# EAGLE design term_clock (EAGLE 9.2.2)
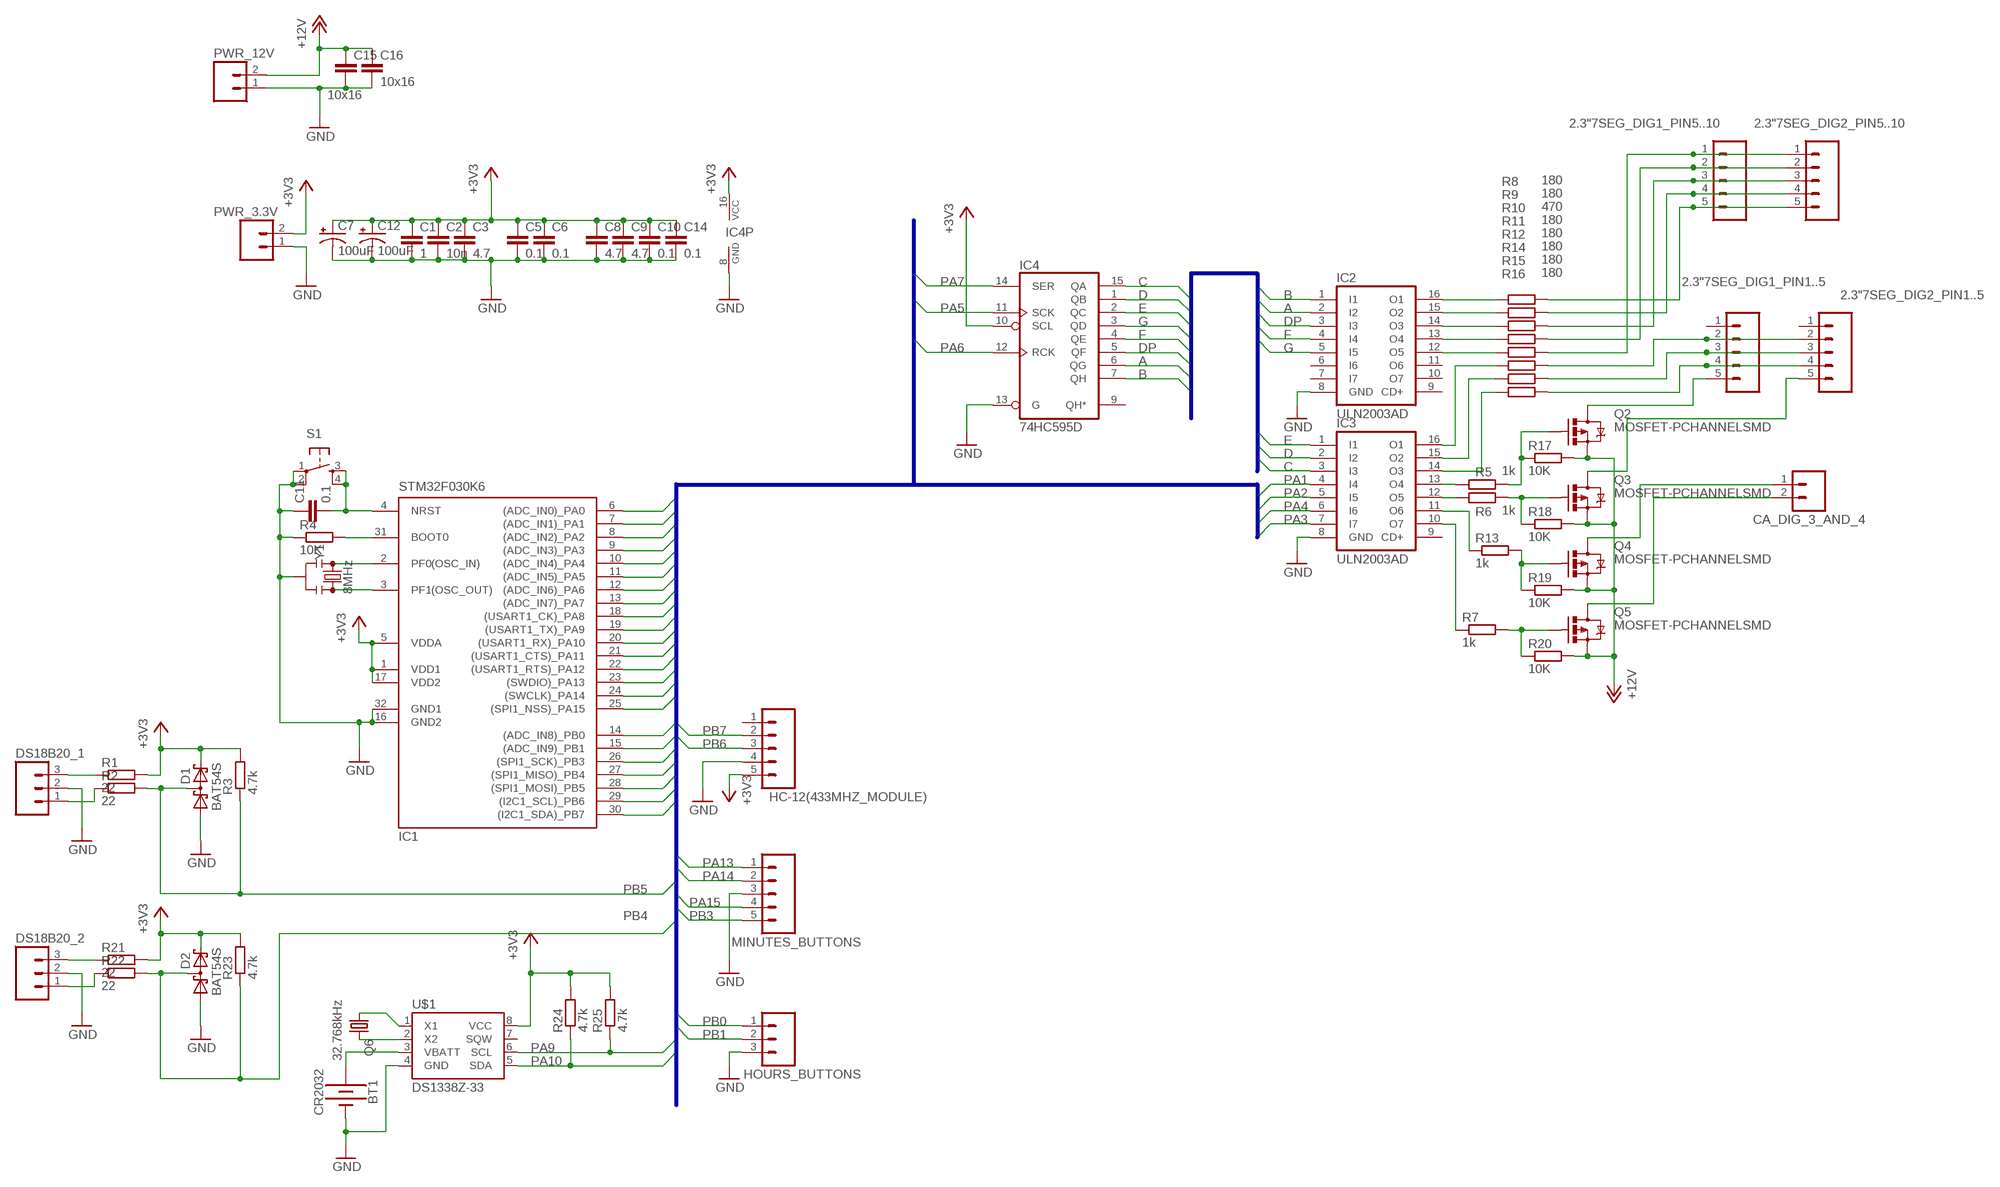
[diagram p0: schematic, sheet 1]

## Parts
2.3"7SEG_DIG1_PIN1..5  M05  [05P]
2.3"7SEG_DIG1_PIN5..10  M05  [05P]
2.3"7SEG_DIG2_PIN1..5  M05  [05P]
2.3"7SEG_DIG2_PIN5..10  M05  [05P]
BT1  CR2032  BATTERY-20MM_PTH  [BATTCOM_20MM_PTH]
C1  1  C-EUC0805  [C0805]
C2  10n  C-EUC0805  [C0805]
C3  4.7  C-EUC0805  [C0805]
C5  0.1  C-EUC0805  [C0805]
C6  0.1  C-EUC0805  [C0805]
C7  100uF  100UF-POLAR-EIA7343-16V-10%(TANT)  [EIA7343]
C8  4.7  C-EUC0805  [C0805]
C9  4.7  C-EUC0805  [C0805]
C10  0.1  C-EUC0805  [C0805]
C11  0.1  C-EUC0805  [C0805]
C12  100uF  100UF-POLAR-EIA7343-16V-10%(TANT)  [EIA7343]
C14  0.1  C-EUC0805  [C0805]
C15  10x16  C-EUC1206  [C1206]
C16  10x16  C-EUC1206  [C1206]
CA_DIG_3_AND_4  M02  [02P]
D1  BAT54S  [SOT23]
D2  BAT54S  [SOT23]
DS18B20_1  M03  [03P]
DS18B20_2  M03  [03P]
HC-12(433MHZ_MODULE)  M05  [05P]
HOURS_BUTTONS  M03  [03P]
IC1  STM32F030K6  [TQFP32-08]
IC2  ULN2003AD  [SO16]
IC3  ULN2003AD  [SO16]
IC4  74HC595D  [SO16]
MINUTES_BUTTONS  M05  [05P]
PWR_3.3V  M02  [02P]
PWR_12V  M02  [02P]
Q2  MOSFET-PCHANNELSMD  [SOT23-3]
Q3  MOSFET-PCHANNELSMD  [SOT23-3]
Q4  MOSFET-PCHANNELSMD  [SOT23-3]
Q5  MOSFET-PCHANNELSMD  [SOT23-3]
Q6  32.768kHz  CRYSTALTC38H  [TC38H]
R1  22  R-EU_R0805  [R0805]
R2  22  R-EU_R0805  [R0805]
R3  4.7k  R-EU_R0805  [R0805]
R4  10K  R-EU_R0805  [R0805]
R5  1k  R-EU_R0603  [R0603]
R6  1k  R-EU_R0603  [R0603]
R7  1k  R-EU_R0603  [R0603]
R8  180  R-EU_R1206  [R1206]
R9  180  R-EU_R1206  [R1206]
R10  470  R-EU_R1206  [R1206]
R11  180  R-EU_R1206  [R1206]
R12  180  R-EU_R1206  [R1206]
R13  1k  R-EU_R0603  [R0603]
R14  180  R-EU_R1206  [R1206]
R15  180  R-EU_R1206  [R1206]
R16  180  R-EU_R1206  [R1206]
R17  10K  R-EU_R0603  [R0603]
R18  10K  R-EU_R0603  [R0603]
R19  10K  R-EU_R0603  [R0603]
R20  10K  R-EU_R0603  [R0603]
R21  22  R-EU_R0805  [R0805]
R22  22  R-EU_R0805  [R0805]
R23  4.7k  R-EU_R0805  [R0805]
R24  4.7k  R-EU_R0805  [R0805]
R25  4.7k  R-EU_R0805  [R0805]
S1  TAC_SWITCHSMD  [TACTILE_SWITCH_SMD]
U$1  DS1338Z-33  DS1307SO8  [SO08]
Y1  8MHz  RESONATOR-8MHZSMD_3.2X1.3  [RESONATOR-SMD-3.2X1.3]

## Nets
+3V3: C1.1 C2.1 C3.1 C5.1 C6.1 C7.A(+) C8.1 C9.1 C10.1 C12.A(+) C14.1 D1.2(C2) D2.2(C2) HC-12(433MHZ_MODULE).5 IC1.1(VDD1) IC1.5(VDDA) IC1.17(VDD2) IC4.10(SCL) IC4.16(VCC) PWR_3.3V.2 R1.2 R3.2 R21.2 R23.2 R24.2 R25.2 U$1.8(VCC)
+12V: C15.1 C16.1 PWR_12V.2 Q2.2(S) Q3.2(S) Q4.2(S) Q5.2(S) R17.2 R18.2 R19.2 R20.2
A: IC2.2(I2) IC4.6(QG)
B: IC2.1(I1) IC4.7(QH)
C: IC3.3(I3) IC4.15(QA)
D: IC3.2(I2) IC4.1(QB)
DP: IC2.3(I3) IC4.5(QF)
E: IC3.1(I1) IC4.2(QC)
F: IC2.4(I4) IC4.4(QE)
G: IC2.5(I5) IC4.3(QD)
GND: BT1.2(-) C1.2 C2.2 C3.2 C5.2 C6.2 C7.C(-) C8.2 C9.2 C10.2 C11.1 C12.C(-) C14.2 C15.2 C16.2 D1.1(A1) D2.1(A1) DS18B20_1.2 DS18B20_2.2 HC-12(433MHZ_MODULE).4 HOURS_BUTTONS.3 IC1.16(GND2) IC1.32(GND1) IC2.8(GND) IC3.8(GND) IC4.8(GND) IC4.13(G) MINUTES_BUTTONS.3 PWR_3.3V.1 PWR_12V.1 R4.1 S1.1 S1.2 U$1.4(GND) Y1.2
N$2: DS18B20_1.3 R1.1
N$3: IC1.2(PF0(OSC_IN)) Y1.1
N$4: IC1.3(PF1(OSC_OUT)) Y1.3
N$5: DS18B20_1.1 R2.1
N$6: DS18B20_2.3 R21.1
N$7: IC1.31(BOOT0) R4.2
N$8: DS18B20_2.1 R22.1
N$10: Q6.2 U$1.2(X2)
N$11: Q6.1 U$1.1(X1)
N$13: BT1.1(+) U$1.3(VBATT)
N$20: C11.2 IC1.4(NRST) S1.3 S1.4
N$81: IC2.16(O1) R8.1
N$82: IC2.15(O2) R9.1
N$83: IC2.14(O3) R10.1
N$84: IC2.13(O4) R11.1
N$85: IC2.12(O5) R12.1
N$86: Q3.1(G) R6.2 R18.1
N$87: Q4.1(G) R13.2 R19.1
N$88: Q5.1(G) R7.2 R20.1
N$89: 2.3"7SEG_DIG2_PIN1..5.5 Q3.3(D)
N$90: CA_DIG_3_AND_4.1 Q4.3(D)
N$91: CA_DIG_3_AND_4.2 Q5.3(D)
N$97: 2.3"7SEG_DIG1_PIN5..10.5 2.3"7SEG_DIG2_PIN5..10.5 R8.2
N$98: 2.3"7SEG_DIG1_PIN5..10.4 2.3"7SEG_DIG2_PIN5..10.4 R9.2
N$99: 2.3"7SEG_DIG1_PIN5..10.3 2.3"7SEG_DIG2_PIN5..10.3 R10.2
N$100: 2.3"7SEG_DIG1_PIN5..10.2 2.3"7SEG_DIG2_PIN5..10.2 R11.2
N$101: 2.3"7SEG_DIG1_PIN5..10.1 2.3"7SEG_DIG2_PIN5..10.1 R12.2
N$102: 2.3"7SEG_DIG1_PIN1..5.5 Q2.3(D)
N$103: 2.3"7SEG_DIG1_PIN1..5.2 2.3"7SEG_DIG2_PIN1..5.2 R14.2
N$104: 2.3"7SEG_DIG1_PIN1..5.3 2.3"7SEG_DIG2_PIN1..5.3 R15.2
N$105: 2.3"7SEG_DIG1_PIN1..5.4 2.3"7SEG_DIG2_PIN1..5.4 R16.2
N$106: IC3.10(O7) R7.1
N$107: IC3.11(O6) R13.1
N$108: IC3.12(O5) R6.1
N$109: Q2.1(G) R5.2 R17.1
N$110: IC3.13(O4) R5.1
N$118: IC3.16(O1) R14.1
N$119: IC3.15(O2) R15.1
N$120: IC3.14(O3) R16.1
PA0: IC1.6((ADC_IN0)_PA0)
PA1: IC1.7((ADC_IN1)_PA1) IC3.4(I4)
PA2: IC1.8((ADC_IN2)_PA2) IC3.5(I5)
PA3: IC1.9((ADC_IN3)_PA3) IC3.7(I7)
PA4: IC1.10((ADC_IN4)_PA4) IC3.6(I6)
PA5: IC1.11((ADC_IN5)_PA5) IC4.11(SCK)
PA6: IC1.12((ADC_IN6)_PA6) IC4.12(RCK)
PA7: IC1.13((ADC_IN7)_PA7) IC4.14(SER)
PA8: IC1.18((USART1_CK)_PA8)
PA9: IC1.19((USART1_TX)_PA9) R25.1 U$1.6(SCL)
PA10: IC1.20((USART1_RX)_PA10) R24.1 U$1.5(SDA)
PA11: IC1.21((USART1_CTS)_PA11)
PA12: IC1.22((USART1_RTS)_PA12)
PA13: IC1.23((SWDIO)_PA13) MINUTES_BUTTONS.1
PA14: IC1.24((SWCLK)_PA14) MINUTES_BUTTONS.2
PA15: IC1.25((SPI1_NSS)_PA15) MINUTES_BUTTONS.4
PB0: HOURS_BUTTONS.1 IC1.14((ADC_IN8)_PB0)
PB1: HOURS_BUTTONS.2 IC1.15((ADC_IN9)_PB1)
PB3: IC1.26((SPI1_SCK)_PB3) MINUTES_BUTTONS.5
PB4: D2.3(C1A2) IC1.27((SPI1_MISO)_PB4) R22.2 R23.1
PB5: D1.3(C1A2) IC1.28((SPI1_MOSI)_PB5) R2.2 R3.1
PB6: HC-12(433MHZ_MODULE).3 IC1.29((I2C1_SCL)_PB6)
PB7: HC-12(433MHZ_MODULE).2 IC1.30((I2C1_SDA)_PB7)
Unconnected: 2.3"7SEG_DIG1_PIN1..5.1 2.3"7SEG_DIG2_PIN1..5.1 HC-12(433MHZ_MODULE).1 IC2.6(I6) IC2.7(I7) IC2.9(CD+) IC2.10(O7) IC2.11(O6) IC3.9(CD+) IC4.9(QH*) U$1.7(SQW)

## Buses
A,B,C,D,E,F,G,DP
PA[0..15],PB[0..7]

## Library data of the parts
2.3"7SEG_DIG1_PIN1..5 2.3"7SEG_DIG1_PIN5..10 2.3"7SEG_DIG2_PIN1..5 2.3"7SEG_DIG2_PIN5..10 HC-12(433MHZ_MODULE) MINUTES_BUTTONS = con-amp-quick:M05: AMP QUICK CONNECTOR; OC_FARNELL: unknown; OC_NEWARK: unknown
BT1 = SparkFun-Batteries:BATTERY: Battery - Single Cell A variety of battery chemistries, sizes, and footprints. Device List: 20MM_PTH - Coin Cell Battery Holder - 20mm (PTH) <https://www.sparkfun.com/products/783> 6.8MM_PTH - Coin Cell Battery Holder - 6.8MM(SMD) <https://www.digikey.com/product-detail/en/seiko-instruments/MS621FE-FL11E/728-1057-ND/1889208?WT.srch=1&gclid=CNOQ5a6LzdQCFZS2wAodXCkE0g> 12MM_SMD - Coin Cell Battery Holder - 12mm (SMD) <https://www.sparkfun.com/products/10592> 12MM_PTH - Coin Cell Battery Holder - 12mm (PTH) <https://www.sparkfun.com/products/7948> 20MM_SMD - 20mm Coin Cell Battery Holder (SMD) (2 legs) Used on the Big Time Watch Kit <https://www.sparkfun.com/products/11734> 20MM_SMD_4LEGS - Coin Cell Battery Holder - 20mm (SMD) <https://www.sparkfun.com/products/11892> 20MM_SMD_4LEGS_OVERPASTE - Coin Cell Battery Holder - 20mm (SMD) <https://www.sparkfun.com/products/11892> (Over-paste on the legs) 24.5MM_PTH - Coin Cell Battery Holder - 24.5mm (PTH) <https://www.sparkfun.com/products/8863> 9V - 9V Battery Holder - PC Mount Used on the SparkFun SparkPunk Sound Kit <https://www.sparkfun.com/products/11177> and SparkFun SparkPunk Sequencer Kit <https://www.sparkfun.com/products/12707> 18650 - Battery Holder - 18650 (PTH) <https://www.sparkfun.com/products/13113> AA - Battery Holder - 1xAA (PTH) <https://www.sparkfun.com/products/7949> AAA - Battery Holder - 1xAAA (PTH) <https://www.sparkfun.com/products/12718> AA_KIT - Battery Holder - 1xAA (PTH) <https://www.sparkfun.com/products/7949> Special kit package - pads only have exposed copper on one side of the board. AAA_KIT - Battery Holder - 1xAAA (PTH) <https://www.sparkfun.com/products/12718> Special kit package - pads only have exposed copper on one side of the board.; PROD_ID: BATT-09031; SF_SKU: PRT-00783
C1-C3 C5 C6 C8-C11 C14-C16 = resistor:C-EU: CAPACITOR, European symbol; SPICEPREFIX: C
C7 C12 = SparkFun-Capacitors:100UF-POLAR: 100µF polarized capacitors A capacitor is a passive two-terminal electrical component used to store electrical energy temporarily in an electric field.; PROD_ID: CAP-08702
CA_DIG_3_AND_4 PWR_3.3V PWR_12V = con-amp-quick:M02: AMP QUICK CONNECTOR; OC_FARNELL: unknown; OC_NEWARK: unknown
D1 D2 = diode:BAT54S: Schottky Diodes Pin connection corrected 2011-05-04 Source: Fairchild .. BAT54.pdf
DS18B20_1 DS18B20_2 HOURS_BUTTONS = con-amp-quick:M03: AMP QUICK CONNECTOR; OC_FARNELL: unknown; OC_NEWARK: unknown
IC1 = my:STM32F030K6: MICROCONTROLLER 32 Kbytes FLASH, 4 kbytes SRAM, USART, SPI, 10-channel 12 bit ADC,
IC2 IC3 = uln-udn:ULN2003A: DRIVER ARRAY
IC4 = 74xx-eu:74*595: 8-bit SHIFT REGISTER, output latch
Q2-Q5 = SparkFun:MOSFET-PCHANNEL
Q6 = crystal:CRYSTAL: CRYSTAL; OC_FARNELL: unknown; OC_NEWARK: unknown
R1-R25 = resistor:R-EU_: RESISTOR, European symbol; SPICEPREFIX: R
S1 = SparkFun:TAC_SWITCH: Momentary Switch Button commonly used for reset or general input. Spark Fun Electronics SKU : COM-00097
U$1 = SparkFun:DS1307
Y1 = SparkFun-Clocks:RESONATOR-8MHZ: 8MHz Resonator Digikey Example <http://www.digikey.com/product-detail/en/murata-electronics-north-america/CSTCE10M0G55-R0/490-1196-1-ND/584633> Frequency: 8MHz Frequency Stability: ±0.2% Frequency Tolerance: ±0.5% Capacitance: 33pF SparkFun Products Arduino Pro Mini 328- 3.3V/8MHz <https://www.sparkfun.com/products/11114> SparkFun Digital Sandbox <https://www.sparkfun.com/products/12651>; PROD_ID: XTAL-08895

## Board
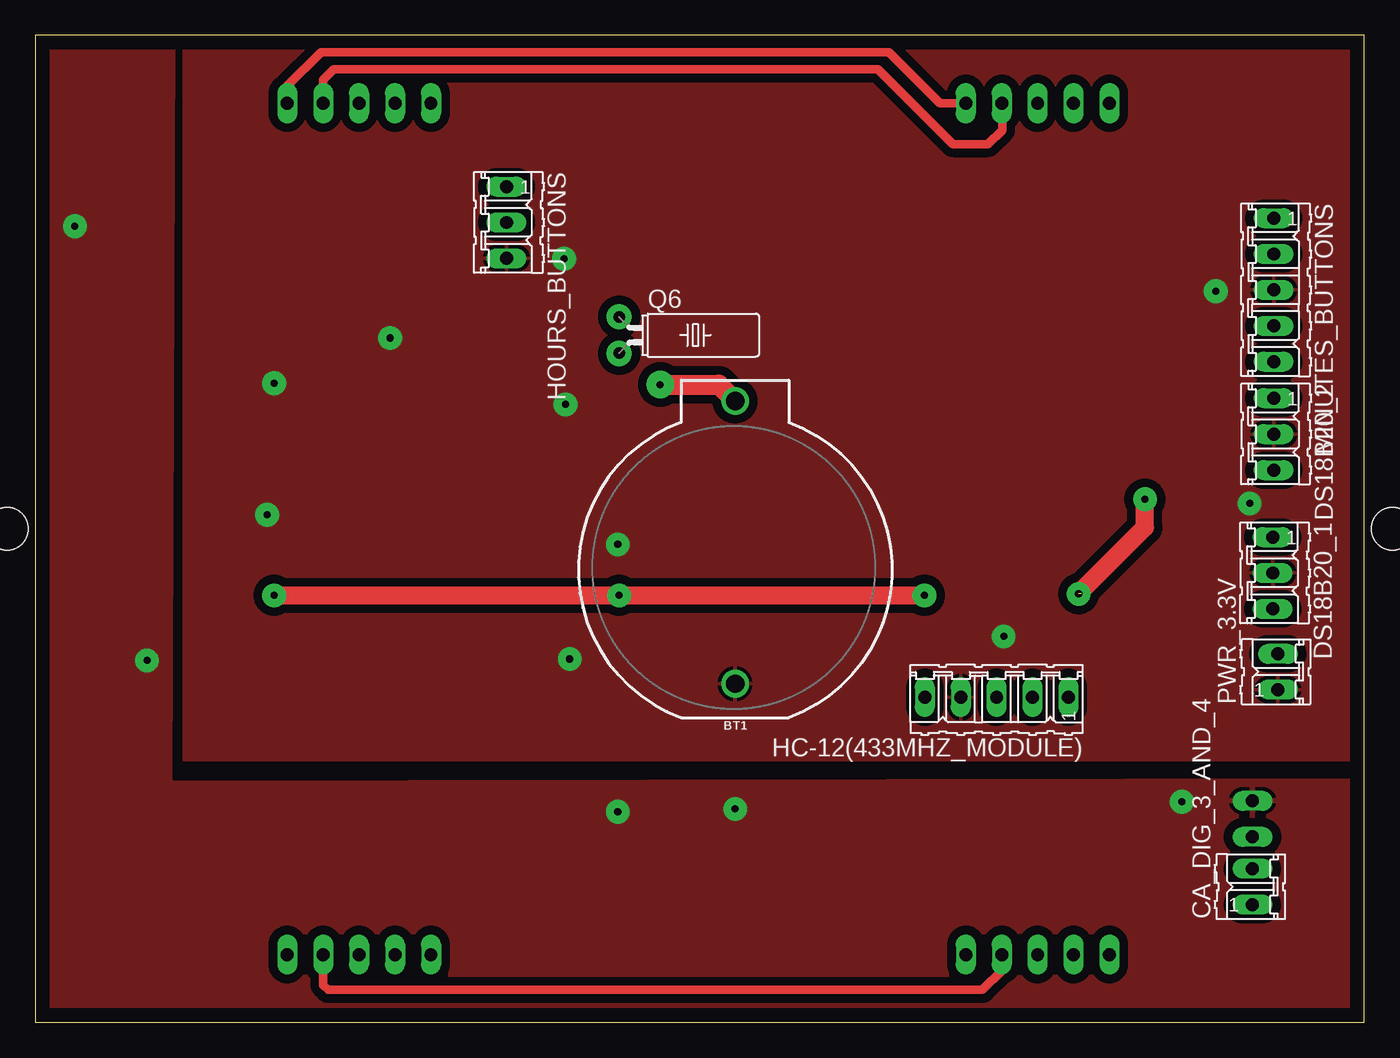
[diagram p1: board, top side]
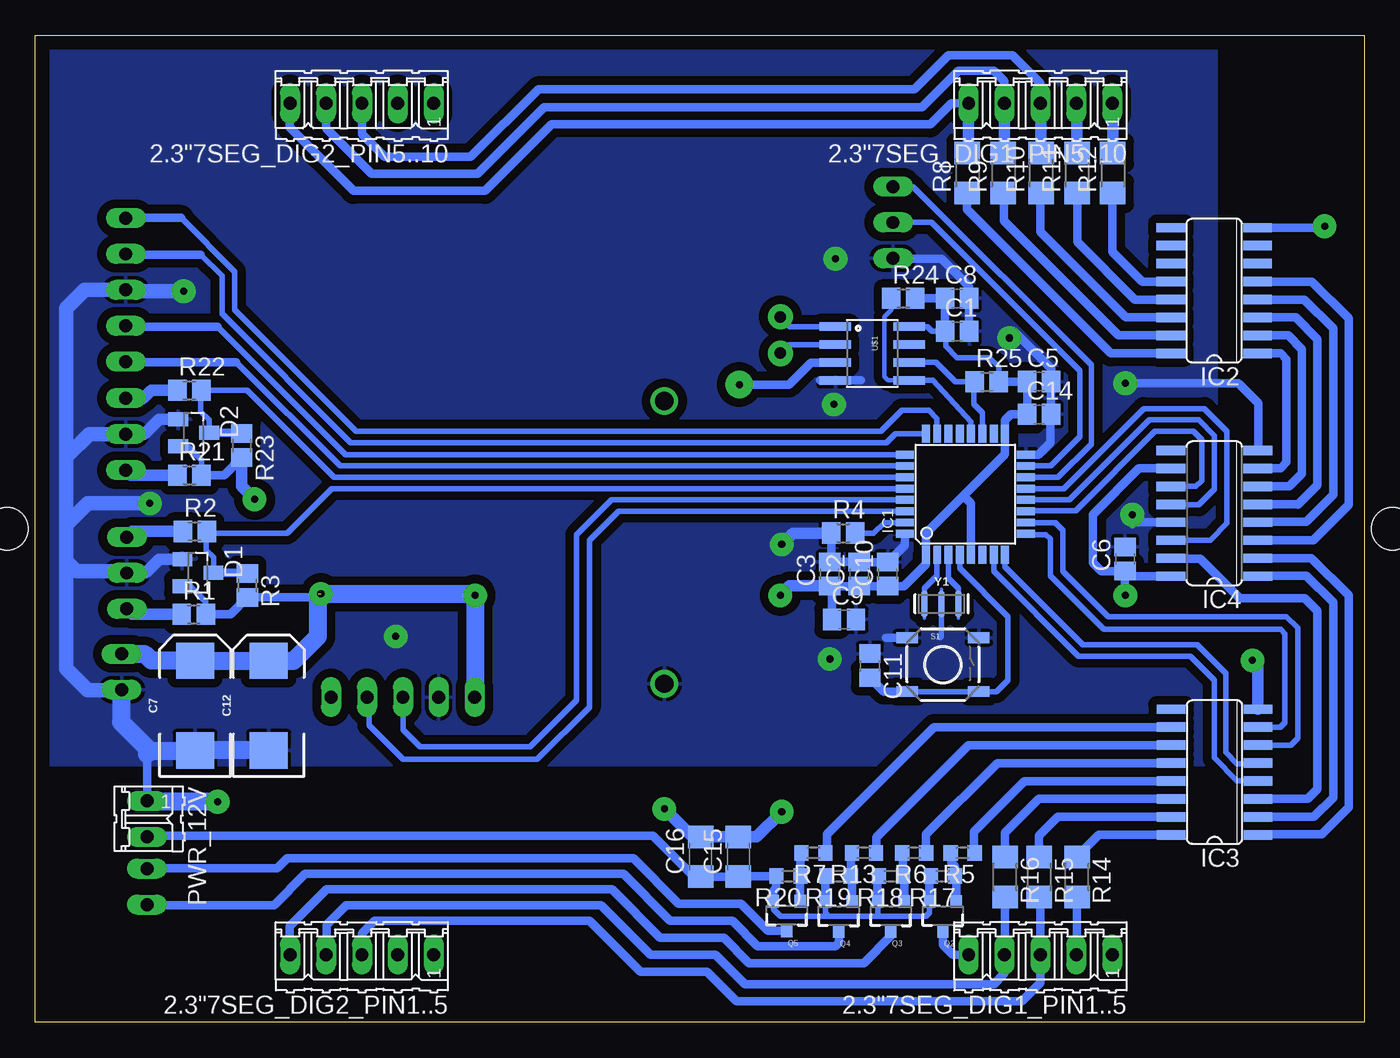
[diagram p2: board, bottom side, seen from below]

Size 94 x 69.8 mm. Coordinates in mm from the lower left corner, seen from the top.
Outline: 0,0 94,0 94,69.8 0,69.8 0,0
Copper layers (1*16): Top 0.035mm / dielectric 1.5mm / Bottom 0.035mm
Design rules "default *": minimum track width 10mil, minimum drill 0.3mm, track to track 8mil, track to pad 8mil, pad to pad 8mil, via to via 8mil, smd to smd 8mil, copper to edge 40mil, drill to drill 8mil, minimum pad ring 10mil, minimum via ring 8mil, stop-mask expansion 4mil, vias tented up to drill 0mil, thermal gap 10mil
Holes 3 mm at -2,34.9 96,34.9

### Footprints (pad centres in the part's own frame; a part is rotated, then mirrored left to right if it is on the bottom)
05P = drill 0.914 long: 1 -5.08,0; 2 -2.54,0; 3 0,0; 4 2.54,0; 5 5.08,0
BATTCOM_20MM_PTH = drill 1.3: 1 11.85,0; 2 -8.15,0
C0805 = smd 1.3 x 1.5: 1 -0.85,0; 2 0.85,0
EIA7343 = smd 2.55 x 2.7: A 3.17,0; C -3.17,0
C1206 = smd 1.6 x 1.8: 1 -1.4,0; 2 1.4,0
02P = drill 0.914 long: 1 -1.27,0; 2 1.27,0
SOT23 = smd 1 x 1.4: 1 -0.95,-1.1; 2 0.95,-1.1; 3 0,1.1
03P = drill 0.914 long: 1 -2.54,0; 2 0,0; 3 2.54,0
TQFP32-08 = smd 1.27 x 0.559: 1 -4.293,2.8; 2 -4.293,2; 3 -4.293,1.2; 4 -4.293,0.4; 5 -4.293,-0.4; 6 -4.293,-1.2; 7 -4.293,-2; 8 -4.293,-2.8; 17 4.293,-2.8; 18 4.293,-2; 19 4.293,-1.2; 20 4.293,-0.4; 21 4.293,0.4; 22 4.293,1.2; 23 4.293,2; 24 4.293,2.8 | smd 0.559 x 1.27: 9 -2.8,-4.293; 10 -2,-4.293; 11 -1.2,-4.293; 12 -0.4,-4.293; 13 0.4,-4.293; 14 1.2,-4.293; 15 2,-4.293; 16 2.8,-4.293; 25 2.8,4.293; 26 2,4.293; 27 1.2,4.293; 28 0.4,4.293; 29 -0.4,4.293; 30 -1.2,4.293; 31 -2,4.293; 32 -2.8,4.293
SO16 = smd 0.66 x 2.032: 1 -4.445,-3.073; 2 -3.175,-3.073; 3 -1.905,-3.073; 4 -0.635,-3.073; 5 0.635,-3.073; 6 1.905,-3.073; 7 3.175,-3.073; 8 4.445,-3.073; 9 4.445,3.073; 10 3.175,3.073; 11 1.905,3.073; 12 0.635,3.073; 13 -0.635,3.073; 14 -1.905,3.073; 15 -3.175,3.073; 16 -4.445,3.073
SOT23-3 = smd 0.8 x 0.9: 1 -0.95,-1; 2 0.95,-1; 3 0,1.1
TC38H = drill 0.813: 1 -1.27,0; 2 1.27,0
R0805 = smd 1.3 x 1.5: 1 -0.85,0; 2 0.85,0
R0603 = smd 1 x 1.1: 1 -0.85,0; 2 0.85,0
R1206 = smd 1.6 x 1.803: 1 -1.422,0; 2 1.422,0
TACTILE_SWITCH_SMD = smd 1.524 x 0.762: 1 -2.54,1.905; 2 2.54,1.905; 3 -2.54,-1.905; 4 2.54,-1.905
SO08 = smd 0.61 x 2.21: 1 -1.905,-2.616; 2 -0.635,-2.616; 3 0.635,-2.616; 4 1.905,-2.616; 5 1.905,2.616; 6 0.635,2.616; 7 -0.635,2.616; 8 -1.905,2.616
RESONATOR-SMD-3.2X1.3 = smd 0.45 x 1.905: 1 -1.2,0; 2 0,0; 3 1.2,0

### Placement (x,y rotation side)
2.3"7SEG_DIG1_PIN1..5  22.9,4.8 180 bottom
2.3"7SEG_DIG1_PIN5..10  22.9,65 180 bottom
2.3"7SEG_DIG2_PIN1..5  70.9,4.8 180 bottom
2.3"7SEG_DIG2_PIN5..10  70.9,65 180 bottom
BT1  49.5,32.1 90 top
C1  28.79,48.87 0 bottom
C2  35.72,31.71 90 bottom
C3  37.8,31.71 90 bottom
C5  22.99,45.32 0 bottom
C6  16.91,32.77 90 bottom
C7  82.7,22.4 90 bottom
C8  28.8,51.2 0 bottom
C9  36.8,28.5 0 bottom
C10  33.7,31.7 90 bottom
C11  34.96,25.23 270 bottom
C12  77.5,22.4 90 bottom
C14  23,43 0 bottom
C15  44.27,11.72 90 bottom
C16  46.94,11.72 90 bottom
CA_DIG_3_AND_4  86.1,9.6 90 top
D1  82.5,31.8 270 bottom
D2  82.8,41.7 270 bottom
DS18B20_1  87.53,31.78 270 top
DS18B20_2  87.6,41.6 270 top
HC-12(433MHZ_MODULE)  68,23 180 top
HOURS_BUTTONS  33.33,56.57 270 top
IC1  28.21,37.35 90 bottom
IC2  10.61,51.76 90 bottom
IC3  10.58,17.71 90 bottom
IC4  10.6,36 90 bottom
MINUTES_BUTTONS  87.6,51.8 270 top
PWR_3.3V  87.9,24.8 90 top
PWR_12V  86.1,14.39 270 bottom
Q2  29.8,7.55 180 bottom
Q3  33.48,7.55 180 bottom
Q4  37.17,7.55 180 bottom
Q5  40.85,7.58 180 bottom
Q6  41.3,48.6 270 top
R1  82.79,28.86 0 bottom
R2  82.72,34.72 0 bottom
R3  79,30.9 270 bottom
R4  36.84,34.6 0 bottom
R5  28.41,11.99 180 bottom
R6  31.83,11.99 180 bottom
R7  38.95,11.99 180 bottom
R8  28.07,60.07 90 bottom
R9  25.53,60.07 90 bottom
R10  22.86,60.07 90 bottom
R11  20.32,60.07 90 bottom
R12  17.78,60.07 90 bottom
R13  35.39,11.99 180 bottom
R14  20.32,10.29 270 bottom
R15  22.99,10.29 270 bottom
R16  25.4,10.29 270 bottom
R17  29.8,10.34 180 bottom
R18  33.48,10.34 180 bottom
R19  37.17,10.34 180 bottom
R20  40.72,10.34 180 bottom
R21  83.1,38.7 0 bottom
R22  83.1,44.7 0 bottom
R23  79.4,40.8 270 bottom
R24  32.6,51.2 0 bottom
R25  26.7,45.3 0 bottom
S1  29.8,25.3 0 bottom
U$1  34.8,47.3 270 bottom
Y1  29.9,29.6 0 bottom

### Tracks (layer width: path | path; a pad name or v marks a point on that pad's centre or on a via)
+3V3  (via drill 0.5 pad 1.68)  (1 unrouted)
  Top 1.27: v16.9,30.2 v41.3,30.2 v62.9,30.2 | v73.8,30.3 78.5,35 v78.5,37
  Bottom 0.406: R1.2 81.94,29.74 83,30.8 83.55,30.8 D1.2 | R21.2 82.25,39.75 83.2,40.7 83.85,40.7 D2.2 | C1.1 29.6,48.83 29.6,47.8 28.8,47 26.5,47 25.85,46.35 R25.2 25.83,45.32 | 23.84,43.01 C14.1 | 23.84,45.3 C5.1 | U$1.8 30.91,49.2 30.58,48.88 C1.1
  Bottom 0.61: C14.1 25,43 25.41,42.59 IC1.17 25.41,40.19 28.35,37.25 | 28.35,37.25 31,34.6 IC1.1 | IC1.1 | IC1.5 27.81,36.71 28.35,37.25 | IC4.10 15.93,39.17 19.2,35.9 19.2,32.5 18.6,31.9 16.94,31.9 C6.1 | C6.1 16.48,31.55 IC4.16 | IC1.1 31,32.4 32.55,30.85 C10.1 35.71,30.85 C2.1 C3.1 37.65,30.71 C9.1 | C6.1 16.91,30.21 v16.9,30.2 | R23.2 80.65,38.7 R21.2 | R3.2 80.19,28.86 R1.2 | R3.2 78.95,30.1 | R3.2 74.25,30.05 74,30.3 | R25.2 23.84,45.3 | C5.1 23.84,43.01 | C1.1 C8.1 R24.2
  Bottom 0.813: R23.2 79.4,37.9 v78.5,37 | C3.1 40.64,30.86 v41.3,30.2
  Bottom 1.27: PWR_3.3V.2 86.27,26.07 85.8,25.6 82.73,25.6 C7.A C12.A 75.73,25.57 74,27.3 74,30.3 63,30.3 v62.9,30.2 62.9,23.02 HC-12(433MHZ_MODULE).5
+12V
  Bottom 0.406: Q2.2 30.75,7.75 31,7.5 34.4,7.5 | 34.4,7.5 37.9,7.5 | 37.9,7.5 41.3,7.5 41.8,8 41.8,8.68 Q5.2 | Q3.2 34.4,8.51 34.4,7.5 | Q4.2 38.12,7.72 37.9,7.5
  Bottom 0.61: PWR_12V.2 86.02,13.2 50.3,13.2 47.42,10.32 C16.1 C15.1 44.24,10.34 R20.2 41.6,10.32 41.6,9.5 41.8,9.3 41.8,8.68 | Q2.2 30.75,10.24 R17.2 | Q3.2 34.44,10.24 R18.2 | Q4.2 38.12,10.24 R19.2
A
  Bottom 0.61: IC2.2 5.38,48.58 4.4,47.6 4.4,38.8 5.3,37.9 IC4.6
B
  Bottom 0.61: IC2.1 5.91,47.31 5.5,46.9 5.5,39.6 5.9,39.2 7.5,39.2 IC4.7
C
  Bottom 0.61: IC3.3 4,15.8 3.3,16.5 3.3,29.1 4.2,30 8.8,30 11.6,32.8 13.65,32.8 IC4.15
D
  Bottom 0.61: IC3.2 3.57,14.53 2.2,15.9 2.2,29.7 4.1,31.6 7.48,31.6 IC4.1
DP
  Bottom 0.61: IC2.3 4.85,49.85 3.3,48.3 3.3,38 4.7,36.6 4.74,36.63 IC4.5
E
  Bottom 0.61: IC4.2 3.73,32.83 1.1,30.2 1.1,15.2 3,13.3 7.47,13.3 IC3.1
F
  Bottom 0.61: IC2.4 4.22,51.12 2.2,49.1 2.2,37.3 4.1,35.4 7.49,35.4 IC4.4
G
  Bottom 0.61: IC2.5 3.69,52.39 1.1,49.8 1.1,36.6 3.6,34.1 IC4.3
GND  (via drill 0.5 pad 1.68)
  Bottom 0.406: Y1.2 29.9,27.3 30,27.2
  Bottom 0.61: IC1.16 23.05,40.15 22.2,41 22.2,42.95 C14.2 22.15,45.27 22.12,45.3 C5.2 22.14,46.24 24.8,48.9 | IC4.13 16.46,35.37 | v16.9,45.2 8.9,45.2 7.5,43.8 7.5,40.47 IC4.8 | IC2.8 2.9,56.2 | 16.6,35.4 16.41,35.21 | IC1.32 32.5,33.75 C10.2 35.71,32.55 C2.2 C3.2 37.69,32.67 R4.1 | S1.1 33.83,27.2 | 27.2,27.2 S1.2 | U$1.4 38.51,45.4 | 36.9,45.4 35.6,45.4 | 86.1,19 PWR_12V.1 | C1.2 27.91,48.9 27.95,48.94 C8.2 27.95,52.05 29.9,54 33.3,54 HOURS_BUTTONS.3
  Bottom 0.813: IC3.8 7.51,25.21 v7.9,25.6 | 2.9,56.2 v2.8,56.3 | v41.2,14.9 42.98,13.12 C15.2 C16.2 47.52,13.12 v49.5,15.1 | D1.1 85.25,32.75 86.2,31.8 87.51,31.8 DS18B20_1.2 | D2.1 85.25,42.65 86.3,41.6 DS18B20_2.2 | R4.1 40.4,34.6 v41.2,33.8
  Bottom 1.016: v85.9,36.7 90.3,36.7 91.8,35.2 | 91.8,35.2 91.8,32.6 | 91.8,32.6 91.1,31.9 87.64,31.9 DS18B20_1.2 | 91.8,35.2 91.8,40 | 91.8,40 90.2,41.6 DS18B20_2.2 | 91.8,32.6 91.8,25 90.3,23.5 87.93,23.5 PWR_3.3V.1 | 91.8,40 91.8,50.5 90.5,51.8 MINUTES_BUTTONS.3 87.5,51.7 v83.5,51.7
  Bottom 1.27: C12.C C7.C 82.73,19.2 85.9,19.2 | 87.93,23.5 87.93,21.23 85.9,19.2 | 85.9,19.2 86.1,19 | v81.1,15.6 86.04,15.6 PWR_12V.1
  other vias: 16.4,35.9 37.5,43.7 37.8,25.7 37.4,54 68.5,27.3 25.1,48.4
  pour Top (isolate 0.61): 0,0 0.1,18.7 0.1,19 0,69.8 9.7,69.7 9.5,16.9 94,17.1 94,0
  pour Bottom (isolate 0.61): 35.9,45.8 37.1,45.8 37.1,44.7 34.8,44.78 34.8,49.95 36.37,52 50.73,52 51.7,50.6 51.7,46.6 42.7,46.6 42.1,46.2 40.7,46.2 39.6,47.3 35.9,47.3 35.8,47.2 35.8,46
  pour Top (isolate 0.61): 10.5,69.5 93.9,69.5 93.9,18.5 10.5,18.5
  pour Bottom (isolate 0.61): 10.4,69.7 93.9,69.7 93.9,18.2 10.4,18.2
N$2
  Bottom 0.813: R1.1 87.14,28.86 DS18B20_1.3
N$3
  Bottom 0.406: IC1.2 30.21,31.59 31.1,30.7 Y1.1
N$4
  Bottom 0.406: IC1.3 29.41,31.41 28.7,30.7 Y1.3
N$5
  Bottom 0.813: R2.1 87.13,34.72 DS18B20_1.1
N$6
  Bottom 0.813: R21.1 87.24,38.7 DS18B20_2.3
N$7
  Bottom 0.406: IC1.31 33.95,35.35 34.7,34.6 R4.2
N$8
  Bottom 0.813: R22.1 85.8,44.7 86.4,44.1 87.56,44.1 DS18B20_2.1
N$9  (via drill 0.5 pad 1.78)
  other vias: 41.3,49.9
N$10
  Bottom 0.406: U$1.2 40.7,47.94 Q6.2
N$11
  Bottom 0.406: U$1.1 40.63,49.2 Q6.1
N$12  (via drill 0.5 pad 1.78)
  other vias: 41.3,47.3
N$13  (via drill 0.5 pad 1.93)
  Top 1.422: v44.2,45.1 48.35,45.1 BT1.1
  Bottom 0.61: U$1.3 39.13,46.66 40.7,45.1 v44.2,45.1
N$20
  Bottom 0.406: S1.3 S1.4 26,23.4 25.2,24.2 25.2,28.7 28.61,32.11 IC1.4
  Bottom 0.61: S1.3 33.98,23.39 C11.2
N$81
  Bottom 0.61: IC2.16 17.91,47.31 28.1,57.5 28.1,58.62 R8.1
N$82
  Bottom 0.61: IC2.15 17.38,48.58 25.5,56.7 25.5,58.62 R9.1
N$83
  Bottom 0.61: IC2.14 16.85,49.85 22.9,55.9 22.9,58.61 R10.1
N$84
  Bottom 0.61: IC2.13 16.22,51.12 20.3,55.2 20.3,58.63 R11.1
N$85
  Bottom 0.61: IC2.12 15.69,52.39 17.8,54.5 17.8,58.63 R12.1
N$86
  Bottom 0.61: Q3.1 32.53,10.24 R18.1 32.63,11.95 R6.2
N$87
  Bottom 0.61: Q4.1 36.22,10.24 R19.1 36.32,11.92 R13.2
N$88
  Bottom 0.61: Q5.1 39.9,10.32 R20.1 39.87,11.92 R7.2
N$89
  Bottom 0.61: Q3.3 33.48,6.12 35.4,4.2 43.5,4.2 45.3,6 49.8,6 53.2,9.4 73.4,9.4 76,6.8 76,4.82 2.3"7SEG_DIG2_PIN1..5.5
N$90
  Bottom 0.61: Q4.3 37.17,5.63 37.4,5.4 42.9,5.4 44.7,7.2 49.1,7.2 52.4,10.5 74.9,10.5 77.1,8.3 86.07,8.3 CA_DIG_3_AND_4.1
N$91
  Bottom 0.61: CA_DIG_3_AND_4.2 86.07,10.9 76.9,10.9 76.2,11.6 51.7,11.6 48.5,8.4 44.1,8.4 42.18,6.48 Q5.3
N$97
  Bottom 0.61: 27.98,61.58 R8.2 | 2.3"7SEG_DIG1_PIN5..10.5 29.2,65 30.7,63.5 57.5,63.5 62.2,58.8 71.5,58.8 76,63.3 76,64.98 2.3"7SEG_DIG2_PIN5..10.5
  Bottom 0.813: 2.3"7SEG_DIG1_PIN5..10.5 27.98,61.58
N$98
  Bottom 0.61: 25.44,61.58 R9.2 | 2.3"7SEG_DIG1_PIN5..10.4 25.44,66.54 26.2,67.3 28.7,67.3 31.3,64.7 58,64.7 62.7,60 70.2,60 73.44,63.24 2.3"7SEG_DIG2_PIN5..10.4
  Bottom 0.813: 2.3"7SEG_DIG1_PIN5..10.4 25.44,61.58
N$99
  Bottom 0.61: 2.3"7SEG_DIG1_PIN5..10.3 22.9,66.4 24.9,68.4 29.4,68.4 31.8,66 58.4,66 63.2,61.2 69.3,61.2 70.9,62.8 2.3"7SEG_DIG2_PIN5..10.3
  Bottom 0.813: R10.2 22.86,64.96 2.3"7SEG_DIG1_PIN5..10.3
N$100
  Top 0.61: 2.3"7SEG_DIG1_PIN5..10.2 20.36,66.66 21.1,67.4 59.6,67.4 64.9,62.1 67.4,62.1 68.4,63.1 68.4,64.96 2.3"7SEG_DIG2_PIN5..10.2
  Bottom 0.813: R11.2 20.32,64.96 2.3"7SEG_DIG1_PIN5..10.2
N$101
  Top 0.61: 2.3"7SEG_DIG1_PIN5..10.1 17.82,66.22 20.2,68.6 60.4,68.6 64,65 2.3"7SEG_DIG2_PIN5..10.1
  Bottom 0.813: R12.2 17.78,64.96 2.3"7SEG_DIG1_PIN5..10.1
N$102
  Bottom 0.61: Q2.3 29.8,5.5 29.1,4.8 2.3"7SEG_DIG1_PIN1..5.5
N$103
  Top 0.61: 2.3"7SEG_DIG1_PIN1..5.2 20.36,2.64 20.7,2.3 67,2.3 68.4,3.7 68.4,4.76 2.3"7SEG_DIG2_PIN1..5.2
  Bottom 0.61: R14.2 20.32,4.84 2.3"7SEG_DIG1_PIN1..5.2
N$104
  Bottom 0.61: R15.2 22.9,8.78 2.3"7SEG_DIG1_PIN1..5.3 22.9,2.8 24.2,1.5 44.4,1.5 46.5,3.6 51.2,3.6 54.8,7.2 70,7.2 70.9,6.3 2.3"7SEG_DIG2_PIN1..5.3
N$105
  Bottom 0.61: R16.2 25.4,4.84 2.3"7SEG_DIG1_PIN1..5.4 25.44,3.46 26.2,2.7 43.8,2.7 45.9,4.8 50.5,4.8 54,8.3 72,8.3 73.4,6.9 73.4,4.84 2.3"7SEG_DIG2_PIN1..5.4
N$106
  Bottom 0.61: 38.06,12.03 R7.1 38,12.09 38,13.3 30.42,20.88 IC3.10
N$107
  Bottom 0.61: 34.63,12.08 R13.1 34.5,12.03 34.5,13.1 27.99,19.61 IC3.11
N$108
  Bottom 0.61: 31.07,12.08 R6.1 31,12.01 31,13.3 25.96,18.34 IC3.12
N$109
  Bottom 0.61: Q2.1 28.85,10.24 R17.1 28.95,11.05 29.2,11.3 29.2,11.94 R5.2
N$110
  Bottom 0.61: IC3.13 24.03,17.07 27.6,13.5 27.6,12.04 R5.1
N$118
  Bottom 0.61: IC3.16 18.77,13.26 R14.1
N$119
  Bottom 0.61: IC3.15 21.67,14.53 23,13.2 23,11.72 R15.1
N$120
  Bottom 0.61: IC3.14 23,15.8 25.4,13.4 R16.1
PA1
  Bottom 0.406: IC1.7 26.2,31.9 20.2,25.9 12.3,25.9 10.6,24.2 10.6,18.7 9,17.1 7.54,17.1 IC3.4
PA2
  Bottom 0.406: IC1.8 25.41,32.21 19.9,26.7 11.8,26.7 9.8,24.7 9.8,19.1 9,18.3 7.55,18.3 IC3.5
PA3
  Bottom 0.406: IC3.7 5.92,20.88 5.6,21.2 5.6,27.5 5.9,27.8 18.4,27.8 22.2,31.6 22.2,34.2 22.5,34.5 23.86,34.5 IC1.9
PA4
  Bottom 0.406: IC1.10 21.85,35.35 21.3,34.8 21.3,31.9 18.1,28.7 5.5,28.7 4.7,27.9 4.7,20.1 5.2,19.6 7.5,19.6 IC3.6
PA5
  Bottom 0.406: IC4.11 11.89,37.91 11.5,38.3 11.5,41.2 12.1,41.8 14.8,41.8 20.4,36.2 23.86,36.2 IC1.11
PA6
  Bottom 0.406: IC1.12 20.85,36.95 15.2,42.6 11.7,42.6 10.6,41.5 10.6,37.7 11.7,36.6 13.64,36.6 IC4.12
PA7
  Bottom 0.406: IC1.13 21.25,37.75 15.6,43.4 11.3,43.4 9.7,41.8 9.7,35.3 10.9,34.1 IC4.14
PA9
  Bottom 0.406: U$1.6 32.12,46.6 32.02,46.7 30.3,46.7 28.9,45.3 27.6,45.3 | R25.1 27.6,45.3 | IC1.19 27.01,43.11 27.6,43.7 27.6,45.3
PA10
  Bottom 0.305: U$1.5 33.7,45.4 33.95,45.65 33.95,49.9 33.45,50.4 R24.1
  Bottom 0.406: IC1.20 27.81,42.48 30.51,45.4 U$1.5
PA13
  Bottom 0.406: 83.7,56.9 79.9,53.1 79.9,50.4 71.3,41.8 34.2,41.8 32.7,43.3 30.8,43.3 30.21,42.71 IC1.23 | 87.58,56.9 MINUTES_BUTTONS.1
  Bottom 0.61: 83.7,56.9 87.58,56.9
PA14
  Bottom 0.406: IC1.24 33.16,41.64 33.8,41 71.7,41 80.8,50.1 80.8,52.8 82.3,54.3 | 87.56,54.3 MINUTES_BUTTONS.2
  Bottom 0.61: 82.3,54.3 87.56,54.3
PA15
  Bottom 0.406: IC1.25 72.05,40.15 81.1,49.2 | 87.54,49.2 MINUTES_BUTTONS.4
  Bottom 0.61: 81.1,49.2 87.54,49.2
PB0
  Bottom 0.406: IC1.14 21.65,38.55 19.3,40.9 19.3,46.5 31.91,59.11 HOURS_BUTTONS.1
PB1
  Bottom 0.406: IC1.15 22.15,39.35 20.1,41.4 20.1,46.1 30.6,56.6 33.29,56.6 HOURS_BUTTONS.2
PB3
  Bottom 0.406: IC1.26 72.45,39.35 79.8,46.7 | 87.58,46.7 MINUTES_BUTTONS.5
  Bottom 0.61: 79.8,46.7 87.58,46.7
PB4
  Bottom 0.406: 79.45,41.7 R23.1 79.35,41.6 | D2.3 81.7,42.6 82.3,43.2 82.3,44.65 R22.2 79,44.7 72.85,38.55 IC1.27
  Bottom 0.61: 79.45,41.7 D2.3
PB5
  Bottom 0.406: D1.3 81.4,32.9 81.9,33.4 81.9,34.69 R2.2 81.75,34.6 76.2,34.6 73.05,37.75 IC1.28
  Bottom 0.61: R3.1 79.05,31.8 D1.3
PB6
  Bottom 0.406: IC1.29 53.25,36.95 55.7,34.5 55.7,22.8 59,19.5 66.8,19.5 68,20.7 HC-12(433MHZ_MODULE).3
PB7
  Bottom 0.406: IC1.30 52.75,36.15 54.8,34.1 54.8,22.3 58.5,18.6 68,18.6 70.4,21 70.4,22.75 HC-12(433MHZ_MODULE).2